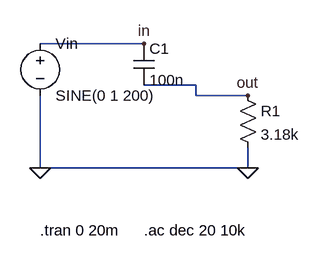
[diagram p0: schematic rc_highpass.asc]
rc_highpass.asc, the LTspice schematic file:
Version 4
SHEET 1 880 680
WIRE 80 160 240 160
WIRE 240 224 320 224
WIRE 320 224 320 240
WIRE 320 240 400 240
WIRE 80 240 80 352
WIRE 400 320 400 352
WIRE 80 352 400 352
FLAG 80 352 0
FLAG 400 352 0
FLAG 240 160 in
FLAG 400 240 out
SYMBOL voltage 80 144 R0
SYMATTR InstName Vin
SYMATTR Value SINE(0 1 200)
SYMBOL cap 224 160 R0
SYMATTR InstName C1
SYMATTR Value 100n
SYMBOL res 384 224 R0
SYMATTR InstName R1
SYMATTR Value 3.18k
TEXT 80 448 Left 2 !.tran 0 20m
TEXT 240 448 Left 2 !.ac dec 20 10k
* End of ltspice-ai-agent output

The netlist it stands for:
* rc_highpass.asc
Vin in 0 SINE(0 1 200)
C1 in out 100n
R1 out 0 3.18k
.tran 0 20m
.ac dec 20 10k
.backanno
.end